# Altium schematic sheet Connection_To_STM32F3DYSCOVERY.SchDoc
size 209 x 297 mm
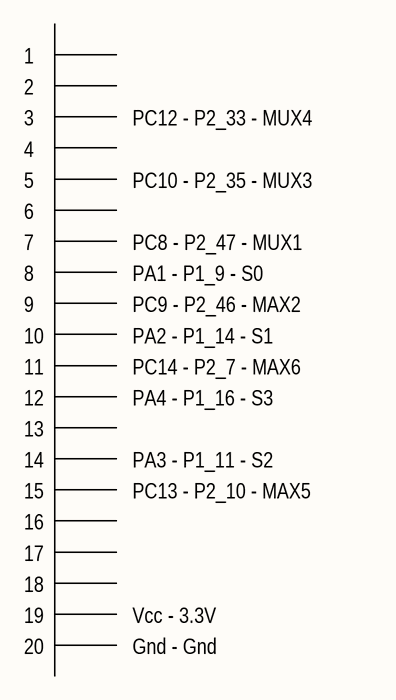
[diagram p0: Connection_To_STM32F3DYSCOVERY.SchDoc]

## Notes on the sheet
- 1
- 2
- 3
- PC12 - P2_33 - MUX4
- 4
- 5
- PC10 - P2_35 - MUX3
- 6
- 7
- 8
- PC8 - P2_47 - MUX1
- PA1 - P1_9 - S0
- 9
- 10
- PC9 - P2_46 - MAX2
- PA2 - P1_14 - S1
- 11
- 12
- 13
- PC14 - P2_7 - MAX6
- PA4 - P1_16 - S3
- 14
- 15
- PC13 - P2_10 - MAX5
- PA3 - P1_11 - S2
- 16
- 17
- 18
- 19
- 20
- Vcc - 3.3V
- Gnd - Gnd
- Перв. примен.
- Справ. №
- Подп. и дата
- Инв. № дубл.
- Взам. инв. №
- Изм.
- Лист
- № докум.
- Подпись
- Дата
- Лит.
- Масса
- Масштаб
- Разраб.
- Пров.
- Т.контр.
- Листов
- Н.контр.
- Инв. № подл.
- Утв.